# EAGLE design AS3364_waveform_VCA_0402_DIL_v1.0-for_design_block (EAGLE 7.7.0)
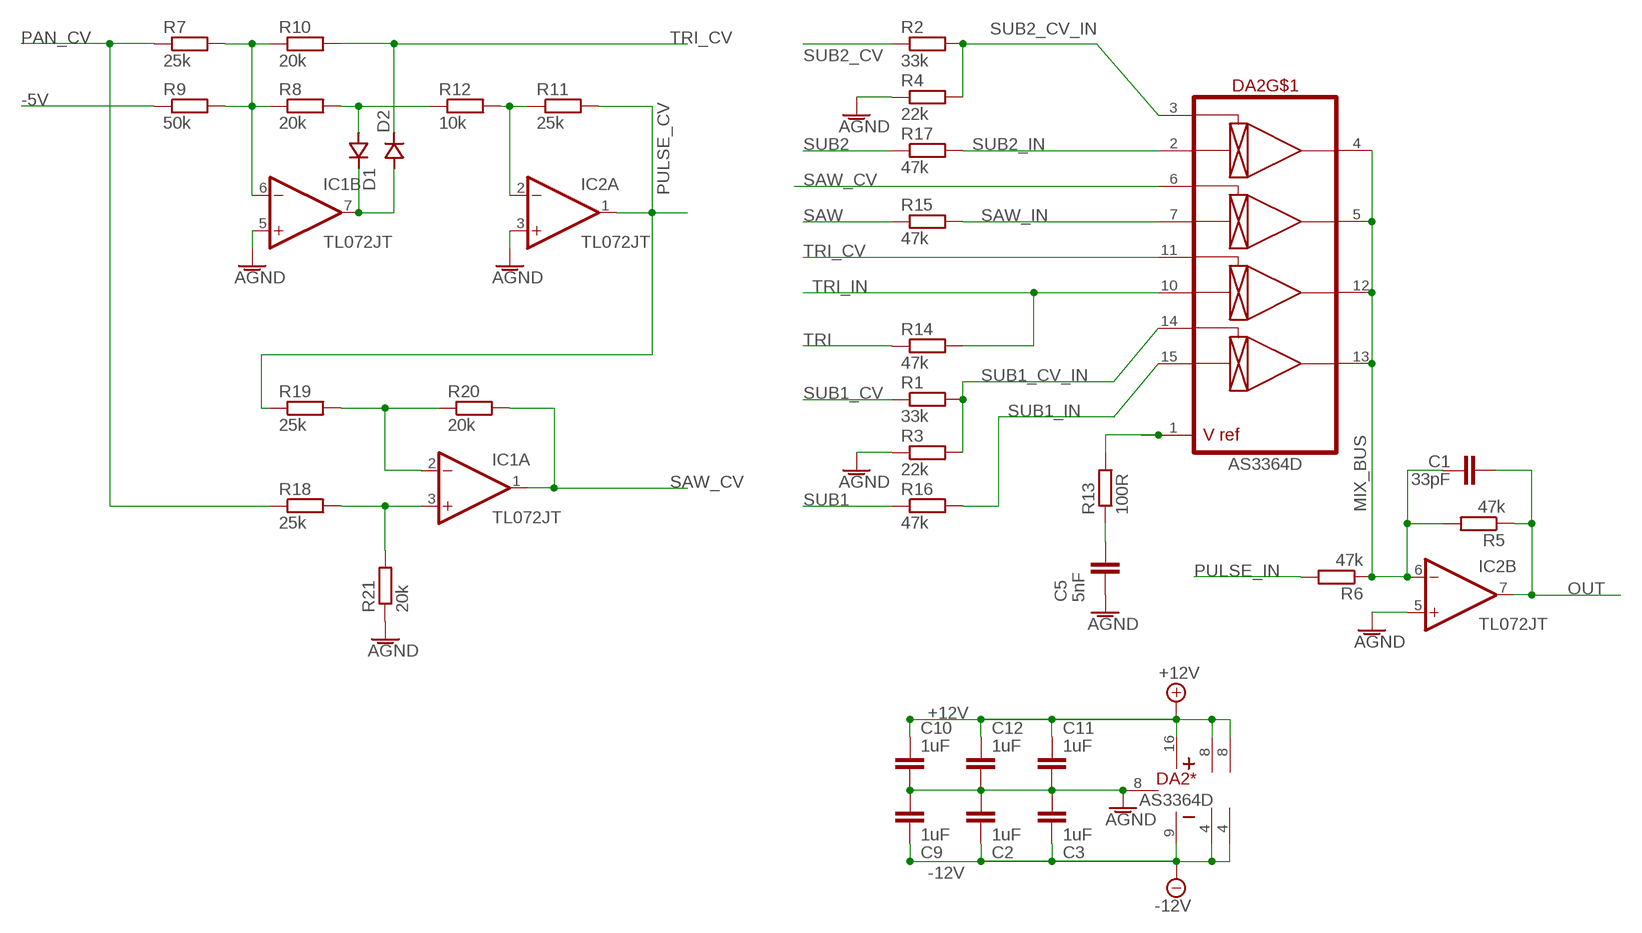
[diagram p0: schematic, sheet 1]

## Parts
C1  33pF  C-EU-J  [C0402-J]
C2  1uF  C-EU-J  [C0402-J]
C3  1uF  C-EU-J  [C0402-J]
C5  5nF  C-EU-J  [C0402-J]
C9  1uF  C-EU-J  [C0402-J]
C10  1uF  C-EU-J  [C0402-J]
C11  1uF  C-EU-J  [C0402-J]
C12  1uF  C-EU-J  [C0402-J]
D1  DIODESOD323  [SOD323J]
D2  DIODESOD323  [SOD323J]
DA2  AS3364D  [DIL16J]
IC1  TL072JT  [TSSOP8J]
IC2  TL072JT  [TSSOP8J]
R1  33k  R-EU_R0402  [R0402]
R2  33k  R-EU_R0402  [R0402]
R3  22k  R-EU_R0402  [R0402]
R4  22k  R-EU_R0402  [R0402]
R5  47k  R-EU_R0402  [R0402]
R6  47k  R-EU_R0402  [R0402]
R7  25k  R-EU_R0402  [R0402]
R8  20k  R-EU_R0402  [R0402]
R9  50k  R-EU_R0402  [R0402]
R10  20k  R-EU_R0402  [R0402]
R11  25k  R-EU_R0402  [R0402]
R12  10k  R-EU_R0402  [R0402]
R13  100R  R-EU_R0402  [R0402]
R14  47k  R-EU_R0402  [R0402]
R15  47k  R-EU_R0402  [R0402]
R16  47k  R-EU_R0402  [R0402]
R17  47k  R-EU_R0402  [R0402]
R18  25k  R-EU_R0402  [R0402]
R19  25k  R-EU_R0402  [R0402]
R20  20k  R-EU_R0402  [R0402]
R21  20k  R-EU_R0402  [R0402]

## Nets
+12V: C10.2 C11.2 C12.2 DA2.16(*:V+) IC1.8(P:V+) IC2.8(P:V+)
-5V: R9.1
-12V: C2.1 C3.1 C9.1 DA2.9(*:V-) IC1.4(P:V-) IC2.4(P:V-)
AGND: C2.2 C3.2 C5.1 C9.2 C10.1 C11.1 C12.1 DA2.8(*:GND) IC1.5(B:+IN) IC2.3(A:+IN) IC2.5(B:+IN) R3.1 R4.1 R21.1
MIX_BUS: C1.2 DA2.4(OUT1) DA2.5(OUT2) DA2.12(OUT3) DA2.13(OUT4) IC2.6(B:-IN) R5.2 R6.1
N$2: DA2.1(VREF) R13.2
N$6: D1.1(C) D2.2(A) IC1.7(B:OUT)
N$8: IC1.6(B:-IN) R7.2 R8.1 R9.2 R10.1
N$11: IC1.3(A:+IN) R18.2 R21.2
N$14: C5.2 R13.1
N$15: IC1.2(A:-IN) R19.2 R20.1
N$18: IC2.2(A:-IN) R11.1 R12.2
N$19: D1.2(A) R8.2 R12.1
OUT: C1.1 IC2.7(B:OUT) R5.1
PAN_CV: R7.1 R18.1
PULSE_CV: IC2.1(A:OUT) R11.2 R19.1
PULSE_IN: R6.2
SAW: R15.1
SAW_CV: DA2.6(CV2) IC1.1(A:OUT) R20.2
SAW_IN: DA2.7(IN2) R15.2
SUB1: R16.1
SUB1_CV: R1.1
SUB1_CV_IN: DA2.14(CV4) R1.2 R3.2
SUB1_IN: DA2.15(IN4) R16.2
SUB2: R17.1
SUB2_CV: R2.1
SUB2_CV_IN: DA2.3(CV1) R2.2 R4.2
SUB2_IN: DA2.2(IN1) R17.2
TRI: R14.1
TRI_CV: D2.1(C) DA2.11(CV3) R10.2
TRI_IN: DA2.10(IN3) R14.2

## Library data of the parts
C1-C3 C5 C9-C12 = joakim:C-EU-J: CAPACITOR, European symbol
D1 D2 = joakim:DIODE: DIODE; MPN: CDSOD323-T05C; OC_FARNELL: 1824860; OC_NEWARK: 79R6078
DA2 = joakim:AS3364: AS3364 quad linear VCA, CEM3360 style. CV is 0 to 2V Vcc-Vee = 26V max, so +/-12V or +15V/-9V
IC1 IC2 = joakim:TL072J: OP AMP
R1-R21 = rcl:R-EU_: RESISTOR, European symbol; SPICEPREFIX: R

## Board
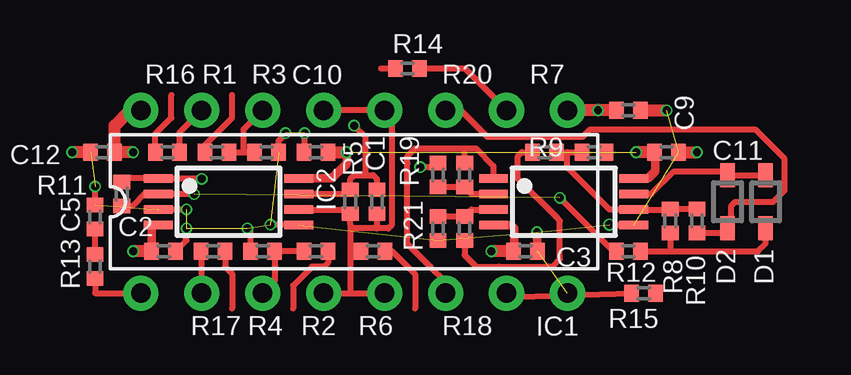
[diagram p1: board, top side]
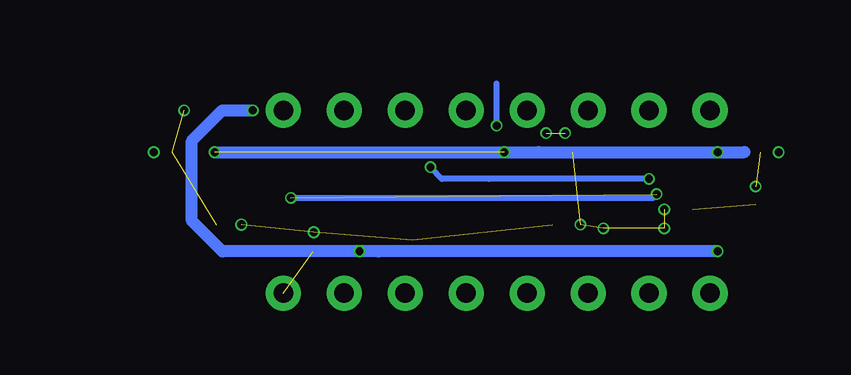
[diagram p2: board, bottom side, seen from below]

No outline drawn. Coordinates in mm, seen from the top.
Copper layers (1*16): Top 0.035mm / dielectric 1.6mm / Bottom 0.035mm
Design rules "jlcpcb-2layers": minimum track width 5mil, minimum drill 0.3mm, track to track 5mil, track to pad 5mil, pad to pad 5mil, via to via 5mil, smd to smd 5mil, copper to edge 0.2mm, drill to drill 6mil, minimum pad ring 10mil, minimum via ring 3mil, stop-mask expansion 4mil, vias tented up to drill 0mil, thermal gap 10mil

### Footprints (pad centres in the part's own frame; a part is rotated, then mirrored left to right if it is on the bottom)
C0402-J = smd 0.6 x 0.7: 1 -0.5,0; 2 0.5,0
SOD323J = smd 1 x 0.6: 1 -1.1,0; 2 1.1,0
DIL16J = drill 0.813: 1 -8.89,-3.81; 2 -6.35,-3.81; 3 -3.81,-3.81; 4 -1.27,-3.81; 5 1.27,-3.81; 6 3.81,-3.81; 7 6.35,-3.81; 8 8.89,-3.81; 9 8.89,3.81; 10 6.35,3.81; 11 3.81,3.81; 12 1.27,3.81; 13 -1.27,3.81; 14 -3.81,3.81; 15 -6.35,3.81; 16 -8.89,3.81
TSSOP8J = smd 1.2 x 0.35: 1 -2.925,0.975; 2 -2.925,0.325; 3 -2.925,-0.325; 4 -2.925,-0.975; 5 2.925,-0.975; 6 2.925,-0.325; 7 2.925,0.325; 8 2.925,0.975
R0402 = smd 0.6 x 0.7: 1 -0.5,0; 2 0.5,0

### Placement (x,y rotation side)
C1  13.02,4.76 270 top
C2  4.13,2.7 0 top
C3  19.21,2.7 0 top
C5  1.27,4.13 270 top
C9  23.5,8.57 0 top
C10  10.48,6.83 0 top
C11  25.08,6.83 180 top
C12  1.59,6.83 0 top
D1  29.21,4.76 270 top
D2  27.62,4.76 90 top
DA2  12.06,4.76 0 top
IC1  20.8,4.76 0 top
IC2  6.83,4.76 0 top
R1  6.35,6.83 0 top
R2  10.48,2.7 180 top
R3  8.41,6.83 180 top
R4  8.26,2.7 0 top
R5  11.91,4.76 270 top
R6  12.86,2.7 0 top
R7  20,6.83 0 top
R8  25.24,3.97 270 top
R9  22.07,6.83 180 top
R10  26.35,3.97 270 top
R11  2.38,5.08 90 top
R12  23.5,2.7 180 top
R13  1.27,2.06 270 top
R14  14.29,10.32 0 top
R15  24.13,0.95 180 top
R16  4.29,6.83 0 top
R17  6.19,2.7 180 top
R18  16.67,3.65 90 top
R19  15.56,5.87 270 top
R20  16.67,5.87 90 top
R21  15.56,3.65 90 top

### Tracks (layer width: path | path; a pad name or v marks a point on that pad's centre or on a via)
+12V  (via drill 0.33)  (3 unrouted)
  Top 0.356: IC2.8 11.13,5.74 11.75,6.35 v11.75,6.83 | IC1.8 24.31,5.74 24.61,6.03 24.61,6.8 C11.2
  Top 0.508: C10.2 v11.75,6.83 | v2.86,6.83 C12.2 2.09,7.94 2.72,8.57 DA2.16 | C11.2 v23.81,6.83
  Bottom 0.508: 1.75,6.83 v2.86,6.83 10.32,6.83 v11.75,6.83 v23.81,6.83
-12V  (via drill 0.33)
  Top 0.356: C2.1 3.63,3.33 3.63,3.79 IC2.4 | IC1.4 18.6,3.79 18.73,3.65 18.73,2.72 C3.1
  Top 0.508: DA2.9 C9.1 v22.23,8.57 | C2.1 v2.86,2.7 | C3.1 v17.78,2.7
  Bottom 0.508: v2.86,2.7 16.99,2.7 | 16.99,2.7 v17.78,2.7 | 16.99,2.7 v17.78,2.7 | v17.78,2.7 23.5,2.7 24.77,3.97 24.77,7.3 23.5,8.57 v22.23,8.57
AGND  (via drill 0.33, 0.35)  (13 unrouted)
  Top 0.254: IC1.5 22.72,3.79 v22.7,3.81 | C5.1 v1.27,5.4 | R3.1 8.91,7.3 9.21,7.6 v9.21,7.62 | v10,7.62 9.98,7.6 C10.1 | IC2.5 9.73,3.81 v8.57,3.81 | IC2.3 v5.08,4.45 | C2.2 5.08,3.15 v5.08,3.65 | R4.1 7.75,3.52 v7.62,3.65
  Top 0.356: C3.2 19.68,2.72 v19.68,3.49
  Top 0.508: C9.2 v25.08,8.57 | C11.1 v26.35,6.83 | C12.1 v0.32,6.83
MIX_BUS
  Top 0.254: DA2.4 11.91,0.95 | 11.91,0.95 DA2.5 | DA2.13 DA2.12 13.65,8.26 13.65,5.87 13.65,3.81 13.49,3.65 13.02,3.65 | 13.02,3.65 11.91,3.65 | IC2.6 11.73,4.44 R5.2 11.91,3.81 11.91,3.65 | C1.2 13.02,3.65 | 11.91,3.65 11.91,2.86 11.91,2.7 | 11.91,2.7 R6.1 | 11.91,2.7 11.91,0.95
N$2
  Top 0.254: DA2.1 1.27,0.95 R13.2
N$6
  Top 0.254: IC1.7 24.45,5.09 25.4,6.03 27.45,6.03 D2.2 D1.1
N$8
  Top 0.254: IC1.6 22.71,4.44 20.95,6.19 20.95,6.83 | R7.2 20.95,6.83 | 20.95,6.83 R9.2 | 23.75,4.47 IC1.6 | IC1.6 25.21,4.44 R8.1 R10.1
N$11
  Top 0.254: IC1.3 16.95,4.44 R18.2 R21.2
N$14
  Top 0.254: R13.1 C5.2
N$15
  Top 0.254: IC1.2 16.95,5.09 R20.1 R19.2
N$18  (via drill 0.33)  (3 unrouted)
  Top 0.254: R11.1 2.83,4.58 3.34,5.09 IC2.2 v5.39,5.09 v5.4,5.08 | v20.64,4.92 22.86,2.7 R12.2
  Bottom 0.254: v20.64,4.92 5.56,4.92 v5.4,5.08
N$19
  Top 0.254: R8.2 25.24,2.7 | R12.1 25.24,2.7 | D1.2 29.21,3.02 28.89,2.7 25.24,2.7
OUT  (via drill 0.33)
  Top 0.254: IC2.7 11.73,5.09 R5.1 11.91,5.71 12.06,5.87 12.54,5.87 | 12.54,5.87 12.86,5.87 13.02,5.71 C1.1 | v12.06,7.94 12.54,7.46 12.54,5.87
  Bottom 0.254: v12.06,7.94 12.06,9.68
PAN_CV
  Top 0.254: R18.1 16.67,2.54 17.14,2.06 18.1,2.06 20.16,2.06 20.32,2.06 20.64,2.38 20.64,3.97 20.48,4.13 18.89,5.71 18.89,6.67 19.05,6.83 R7.1
PULSE_CV  (via drill 0.33)
  Top 0.254: R11.2 2.54,5.74 IC2.1 5.69,5.74 v5.71,5.71 | R19.1 15.39,6.2 v14.82,6.2
  Bottom 0.254: v5.71,5.71 12.38,5.71 14.34,5.71 14.34,5.73 v14.82,6.2
PULSE_IN
  Top 0.254: R6.2 13.65,2.7 14.61,1.75 14.61,0.32
SAW_CV
  Top 0.254: 17.85,5.71 IC1.1 17.87,6.26 17.14,6.99 16.67,6.99 | DA2.6 15.88,1.43 15.24,2.06 14.29,3.02 14.29,6.35 14.29,6.67 14.61,6.99 16.67,6.99 | R20.2 16.67,6.99
SAW_IN
  Top 0.254: DA2.7 18.26,0.79 R15.2
SUB1
  Top 0.254: R16.1 3.79,7.6 4.45,8.26 4.45,9.21
SUB1_CV
  Top 0.254: R1.1 5.85,7.12 6.99,8.26 6.99,9.21
SUB1_CV_IN
  Top 0.254: R1.2 7.46,6.83 | 7.46,6.83 7.62,6.83 R3.2 | 7.46,6.83 7.46,7.78 DA2.14
SUB1_IN
  Top 0.254: DA2.15 4.79,7.64 R16.2
SUB2
  Top 0.254: R17.1 6.69,2.06 6.99,1.77 6.99,0.32
SUB2_CV
  Top 0.254: R2.1 10.98,2.22 10.82,2.06 10.32,2.06 9.53,1.27 9.53,0.32
SUB2_CV_IN
  Top 0.254: R2.2 R4.2 8.76,1.45 DA2.3
SUB2_IN
  Top 0.254: R17.2 5.69,0.98 DA2.2
TRI
  Top 0.254: 13.18,10.32 R14.1
TRI_CV
  Top 0.254: R10.2 27.43,3.47 D2.1 27.78,3.82 27.78,4.6 27.94,4.76 29.53,4.76 30,5.24 30,6.54 28.77,7.78 21.91,7.78 21.59,7.46 17.62,7.46 17.46,7.62 16.51,8.57 DA2.11
TRI_IN
  Top 0.254: R14.2 16.67,10.32 DA2.10